# Altium schematic sheet Stepper_Driver.SchDoc: Stepper Driver
size A4; DocumentNumber: 3; SheetNumber: 3; SheetTotal: 8
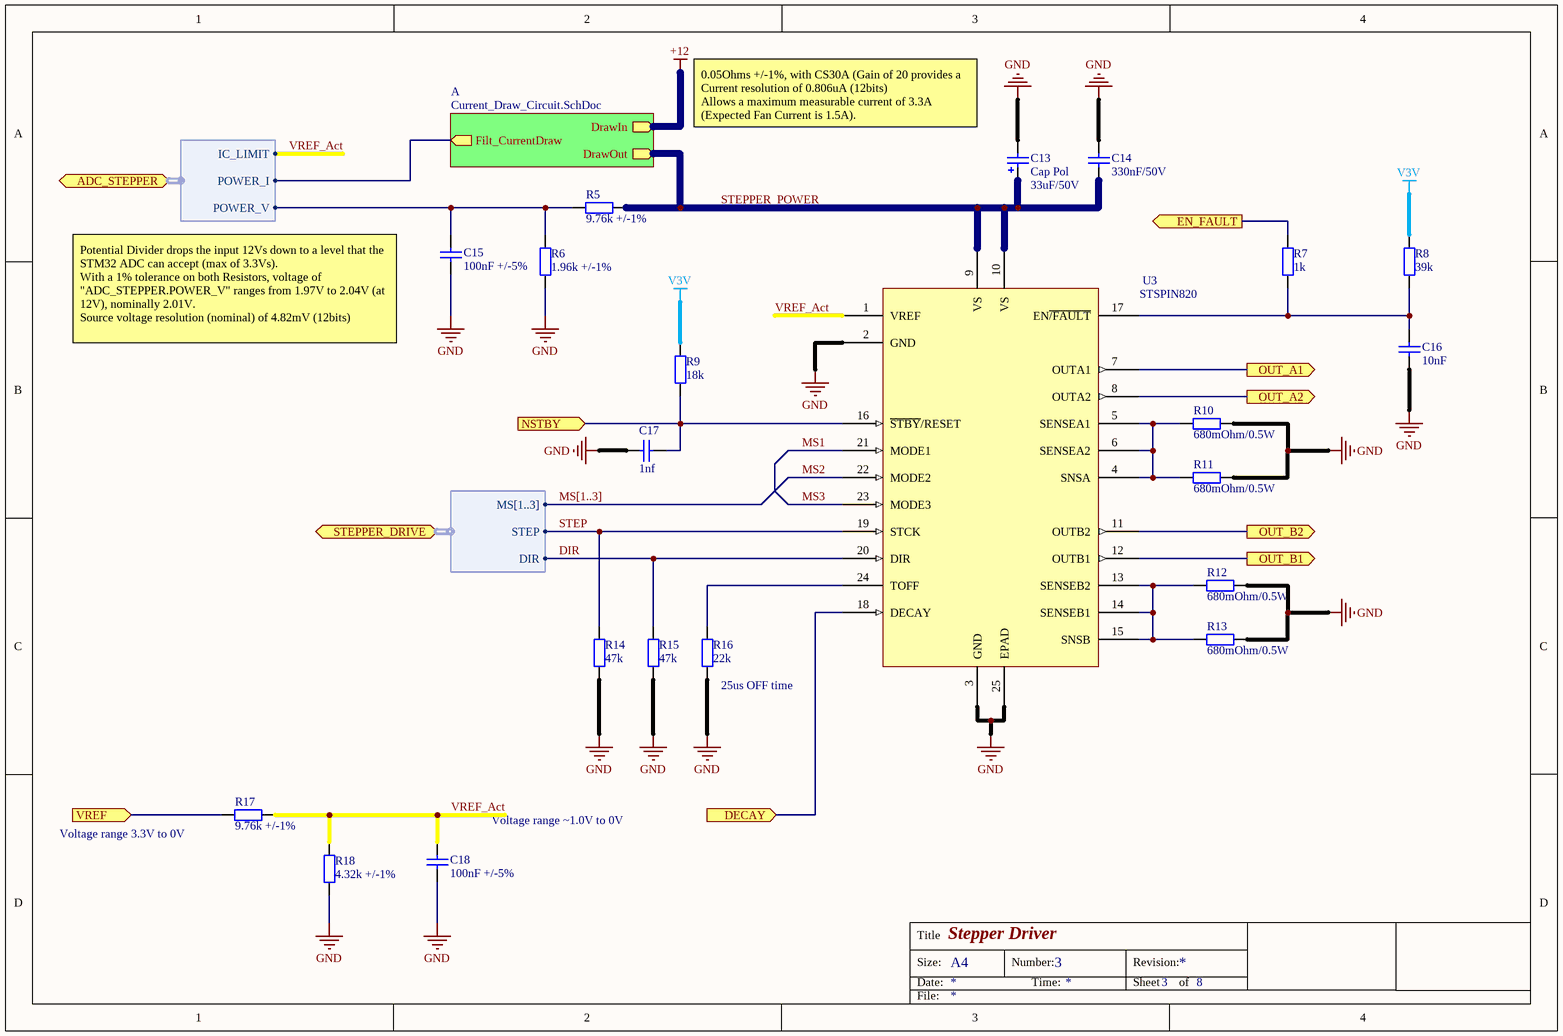
[diagram p0: Stepper_Driver.SchDoc]

## Parts
C13  Cap Pol  value 33uF/50V  [CAPAE7066X77M]
C14  value 330nF/50V  [CAPC3216X06N (1206)]  (hidden comment: Cap Semi)
C15  value 100nF +/-5%  [CAPC1608X06N (0603)]  (hidden comment: Cap Semi)
C16  value 10nF  [CAPC1608X06N (0603)]  (hidden comment: Cap Semi)
C17  value 1nf  [CAPC1608X06N (0603)]  (hidden comment: Cap Semi)
C18  value 100nF +/-5%  [CAPC1608X06N (0603)]  (hidden comment: Cap Semi)
R5  value 9.76k +/-1%  [RESC1608X06N (0603)]  (hidden comment: Res)
R6  value 1.96k +/-1%  [RESC1608X06N (0603)]  (hidden comment: Res)
R7  value 1k  [RESC1608X06N (0603)]  (hidden comment: Res)
R8  value 39k  [RESC1608X06N (0603)]  (hidden comment: Res)
R9  value 18k  [RESC1608X06N (0603)]  (hidden comment: Res)
R10  value 680mOhm/0.5W  [RESC2012X06N (0805)]  (hidden comment: Res)
R11  value 680mOhm/0.5W  [RESC2012X06N (0805)]  (hidden comment: Res)
R12  value 680mOhm/0.5W  [RESC2012X06N (0805)]  (hidden comment: Res)
R13  value 680mOhm/0.5W  [RESC2012X06N (0805)]  (hidden comment: Res)
R14  value 47k  [RESC1608X06N (0603)]  (hidden comment: Res)
R15  value 47k  [RESC1608X06N (0603)]  (hidden comment: Res)
R16  value 22k  [RESC1608X06N (0603)]  (hidden comment: Res)
R17  value 9.76k +/-1%  [RESC1608X06N (0603)]  (hidden comment: Res)
R18  value 4.32k +/-1%  [RESC1608X06N (0603)]  (hidden comment: Res)
U3  STSPIN820  [QFN50P400X400X110-25N]

## Sub-sheets
A = Current_Draw_Circuit.SchDoc: Filt_CurrentDraw (out), DrawIn, DrawOut

## Ports
ADC_STEPPER (harness ADC_STEPPER), DECAY (in), EN_FAULT (out), NSTBY (in), OUT_A1 (out), OUT_A2 (out), OUT_B1 (out), OUT_B2 (out), STEPPER_DRIVE (harness STEPPER_DRIVE), VREF (in)

## Harnesses
STEPPER_DRIVE: DIR, MS[1..3], STEP
ADC_STEPPER: IC_LIMIT, POWER_I, POWER_V

## Nets
+12: sheet A/DrawIn
GND: C13.2 C14.1 C15.1 C16.2 C17.2 C18.1 R6.1 R10.2 R11.2 R12.2 R13.2 R14.2 R15.2 R16.2 R18.1 U3.2(GND) U3.3(GND) U3.25(EPAD)
V3V: R8.2 R9.2
DECAY: U3.18(DECAY) ; port DECAY
DIR: R15.1 U3.20(DIR) ; port STEPPER_DRIVE.DIR
EN_FAULT: R7.2 ; port EN_FAULT
MS1: U3.21(MODE1)
MS2: U3.22(MODE2)
MS3: U3.23(MODE3)
NSTBY: C17.1 R9.1 U3.16(~{STBY}/RESET) ; port NSTBY
OUT_A1: U3.7(OUTA1) ; port OUT_A1
OUT_A2: U3.8(OUTA2) ; port OUT_A2
OUT_B1: U3.12(OUTB1) ; port OUT_B1
OUT_B2: U3.11(OUTB2) ; port OUT_B2
STEP: R14.1 U3.19(STCK) ; port STEPPER_DRIVE.STEP
STEPPER_POWER: C13.1 C14.2 R5.2 U3.9(VS) U3.10(VS) ; sheet A/DrawOut
VREF: R17.1 ; port VREF
VREF_Act: C18.2 R17.2 R18.2 U3.1(VREF) ; port ADC_STEPPER.IC_LIMIT
NetC15_2: C15.2 R5.1 R6.2 ; port ADC_STEPPER.POWER_V
NetC16_1: C16.1 R7.1 R8.1 U3.17(EN~{/FAULT})
NetR10_1: R10.1 R11.1 U3.4(SNSA) U3.5(SENSEA1) U3.6(SENSEA2)
NetR12_1: R12.1 R13.1 U3.13(SENSEB2) U3.14(SENSEB1) U3.15(SNSB)
NetR16_1: R16.1 U3.24(TOFF)
(unnamed): sheet A/Filt_CurrentDraw, port ADC_STEPPER.POWER_I

## Buses and harness runs
bus MS[1..3]

## Notes on the sheet
- (near C13) 0.05Ohms +/-1%, with CS30A (Gain of 20 provides a Current resolution of 0.806uA (12bits)
  Allows a maximum measurable current of 3.3A (Expected Fan Current is 1.5A).
- Potential Divider drops the input 12Vs down to a level that the STM32 ADC can accept (max of 3.3Vs).
  With a 1% tolerance on both Resistors, voltage of "ADC_STEPPER.POWER_V" ranges from 1.97V to 2.04V (at 12V), nominally 2.01V.
  Source voltage resolution (nominal) of 4.82mV (12bits)
- (near R16) 25us OFF time
- (near R17) Voltage range 3.3V to 0V
- Voltage range ~1.0V to 0V
- Title
- Size:
- Date:
- A4
- Number:
- Time:
- Revision:
- Sheet
- of
- File:

## Library data of the parts
C13 = Cap Pol: Polarized Capacitor (Surface Mount); Published: 8-Jun-2000; LatestRevisionDate: 29-May-2009; LatestRevisionNote: IPC-7351 Footprint Added.; PackageReference: C0805; Publisher: Altium Limited; PackageDescription: Chip Capacitor
C14-C18 = Cap Semi: Capacitor (Semiconductor SIM Model); Published: 8-Jun-2000; LatestRevisionDate: 29-May-2009; LatestRevisionNote: IPC-7351 Footprint Added.; PackageReference: X7R; Publisher: Altium Limited; PackageDescription: Chip Capacitor
R5-R18 = Res: Resistor; Published: 8-Jun-2000; LatestRevisionDate: 17-Jul-2002; LatestRevisionNote: Re-released for DXP Platform.; PackageReference: MCWR06; Publisher: Altium Limited; PackageDescription: SMD Chip Resistor
U3 = STSPIN820: Stepper IC